# Altium project ESP32-CAM-POW.PrjPCB
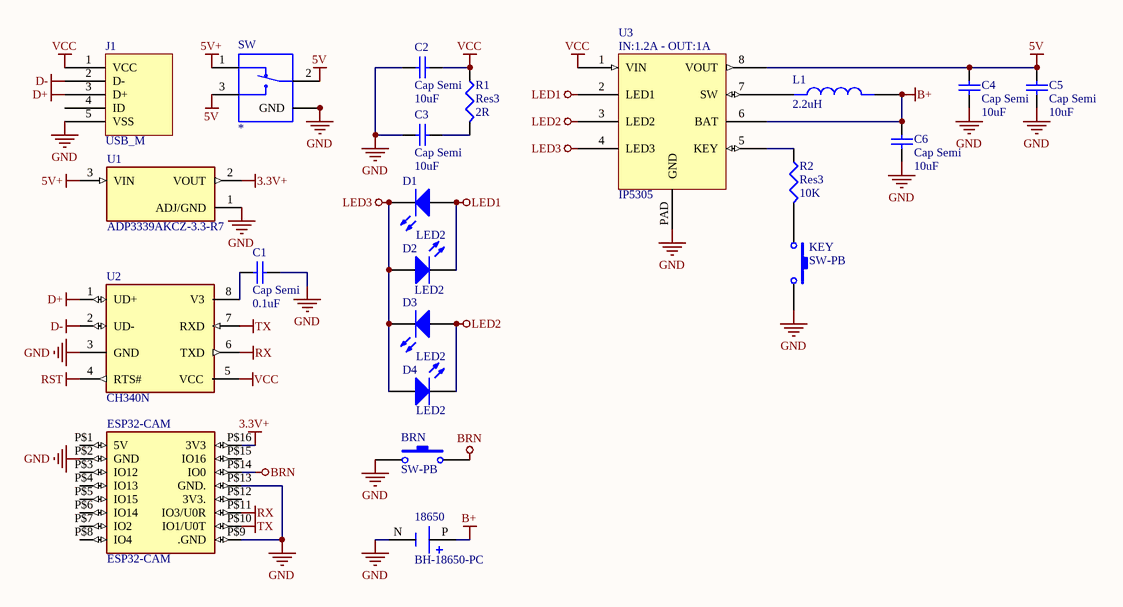
[diagram p0: POW.SchDoc]
1 sheet, 22 parts. Net scope: global (net labels, ports and power ports of the same name join across sheets).
Board file: POW.PcbDoc

## Sheet POW.SchDoc
size A4

### Parts
18650  BH-18650-PC  [BAT_BH-18650-PC]
BRN  SW-PB  [SW_PB2_B1]
C1  Cap Semi  value 0.1uF  [C1206]
C2  Cap Semi  value 10uF  [C1210]
C3  Cap Semi  value 10uF  [C1210]
C4  Cap Semi  value 10uF  [C1210]
C5  Cap Semi  value 10uF  [C1210]
C6  Cap Semi  value 10uF  [C1210]
D1  LED2  [3.2X1.6X1.1]
D2  LED2  [3.2X1.6X1.1]
D3  LED2  [3.2X1.6X1.1]
D4  LED2  [3.2X1.6X1.1]
ESP32-CAM  ESP32-CAM  [ESP32-CAM]
J1  USB_M  [USB_MICRO]
KEY  SW-PB  [SW_PB2_B1]
L1  2.2uH  [IND_1253AY-100M=P3]
R1  Res3  value 2R  [J1-0603]
R2  Res3  value 10K  [J1-0603]
SW  1437575-1  [SW_MLL1200S]  (value not drawn)
U1  ADP3339AKCZ-3.3-R7  [SOT229P700X180-4N]
U2  CH340N  [SOP-8]
U3  IP5305  [SOP-8]

### Nets
3.3V+: ESP32-CAM.P$16(3V3) U1.2(VOUT)
5V: C4.2 C5.2 SW.2 SW.3 U3.8(VOUT)
5V+: SW.1 U1.3(VIN)
B+: 18650.P(POS) C6.2 L1.2 U3.6(BAT)
BRN: BRN.2 ESP32-CAM.P$14(IO0)
D+: J1.3(D+) U2.1(UD+)
D-: J1.2(D-) U2.2(UD-)
GND: 18650.N(NEG) BRN.1 C1.2 C2.1 C3.2 C4.1 C5.1 C6.1 ESP32-CAM.P$2(GND) ESP32-CAM.P$9(.GND) ESP32-CAM.P$13(GND.) J1.5(VSS) KEY.2 SW.G1(GND) SW.G2(GND) SW.G3(GND) SW.G4(GND) U1.1(ADJ/GND) U2.3(GND) U3.PAD(GND)
LED1: D1.1(A) D2.2(K) U3.2(LED1)
LED2: D3.1(A) D4.2(K) U3.3(LED2)
LED3: D1.2(K) D2.1(A) D3.2(K) D4.1(A) U3.4(LED3)
RST: U2.4(RTS#)
RX: ESP32-CAM.P$11(IO3/U0R) U2.6(TXD)
TX: ESP32-CAM.P$10(IO1/U0T) U2.7(RXD)
VCC: C2.2 J1.1(VCC) R1.1 U2.5(VCC) U3.1(VIN)
NetC1_1: C1.1 U2.8(V3)
NetC3_1: C3.1 R1.2
NetKEY_1: KEY.1 R2.2
NetL1_1: L1.1 U3.7(SW)
NetR2_1: R2.1 U3.5(KEY)

Not connected (* = marked no-connect by the designer): ESP32-CAM P$1(5V) P$3(IO12) P$4(IO13) P$5(IO15) P$6(IO14) P$7(IO2) P$8(IO4) P$12(3V3.) P$15(IO16); J1 4(ID)

### Notes on the sheet
- (in symbol IP5305) IN:1.2A - OUT:1A

### Library data of the parts
18650 = BH-18650-PC: Battery Holder _Open_ 18650 1 Cell PC Pin; MF: MPD _Memory; Package: DFN-8 Memory Protection Devices; MP: BH-18650-PC; Value: *; Availability: Unavailable; SnapEDA_Link: https://www.snapeda.com/parts/BH-18650-PC/MPD%20%28Memory%20Protection%20Devices%29/view-part/779074/?ref=snap; Price: None
BRN KEY = SW-PB: 峚雄羲壽; Published: 24-Mar-1999; LatestRevisionDate: 17-Jul-2002; LatestRevisionNote: Re-released for DXP Platform.; PackageReference: SPST-2; Publisher: Altium Limited
C1-C6 = Cap Semi: Capacitor (Semiconductor SIM Model); Published: 8-Jun-2000; LatestRevisionDate: 29-May-2009; LatestRevisionNote: IPC-7351 Footprint Added.; PackageReference: C1206; Publisher: Altium Limited; PackageDescription: Chip Capacitor
D1-D4 = LED2: Typical RED, GREEN, YELLOW, AMBER GaAs LED; Published: 8-Jun-2000; LatestRevisionDate: 17-Jul-2002; LatestRevisionNote: Re-released for DXP Platform.; PackageVersion: Feb-2002; PackageReference: 3.2X1.6X1.1; Publisher: Altium Limited; PackageDescription: SM LED; 2 Flat Leads
ESP32-CAM = ESP32-CAM: The smallest 802.11b/g/n Wi-Fi BT SoC Module; MF: AI-Thinker; Price: None; Value: *; Check_prices: https://www.snapeda.com/parts/ESP32-CAM/AI-Thinker/view-part/5507632/?ref=eda; Package: Package; Availability: No availability data; MP: ESP32-CAM; SnapEDA_Link: https://www.snapeda.com/parts/ESP32-CAM/AI-Thinker/view-part/5507632/?ref=snap
J1 = USB_M: MicroUSB諉諳
L1 = 1253AY-100M=P3: Inductor with Inductance: 10uH Tol. +/-20%, Package: 2424 (6060); MF: Murata; Check_prices: https://www.snapeda.com/parts/1253AY-100M=P3/Murata/view-part/1552786/?ref=eda; Value: *; Price: None; Availability: Bad; Package: NONSTANDARD; MP: 1253AY-100M=P3; SnapEDA_Link: https://www.snapeda.com/parts/1253AY-100M=P3/Murata/view-part/1552786/?ref=snap
R1 R2 = Res3: Resistor; Published: 8-Jun-2000; LatestRevisionDate: 29-May-2009; LatestRevisionNote: IPC-7351 Footprint Added.; PackageReference: J1-0603; Publisher: Altium Limited; PackageDescription: Chip Resistor
SW = MLL1200S: Slide Switch SPDT Surface Mount, Right Angle; MF: TE Connectivity; Value: *; Package: None; Digi-Key_Purchase_URL: https://www.digikey.lt/product-detail/en/te-connectivity-alcoswitch-switches/MLL1200S/450-1577-ND/1201378?utm_source=snapeda&utm_medium=aggregator&utm_campaign=symbol; Digi-Key_Part_Number: 450-1577-ND; TE_purchase_URL: https://www.te.com/usa-en/product-1437575-1.html?te_bu=Cor&te_type=disp&te_campaign=seda_glo_cor-seda-global-disp-prtnr-fy19-seda-model-bom-cta_sma-317_1&elqCampaignId=32493; SnapEDA_Link: https://www.snapeda.com/parts/MLL1200S/TE%20Connectivity%20ALCOSWITCH%20Switches/view-part/1494234/?ref=snap; MP: MLL1200S; Comment_1: *
U1 = AMS1117-3.3: Sot223/Pkg 1-Amp 3.3-Volt Low Drop Out Voltage Regulatator; MF: Advanced Monolithic Systems; Price: None; Package: None; Value: *; MP: AMS1117-3.3; Availability: Unavailable; SnapEDA_Link: https://www.snapeda.com/parts/AMS1117-3.3/Advanced%20Monolithic%20Systems/view-part/53450/?ref=snap
U2 = CH340N: Complete single cell Li-Ion battery with a constant current / constant voltage linear charger; MP: TP4056; MF: NanJing Top Power ASIC Corp.; Package: Package Analog Devices; Value: *; SnapEDA_Link: https://www.snapeda.com/parts/TP4056%20/NanJing%20Top%20Power%20ASIC%20Corp./view-part/2888426/?ref=snap; Price: None; Availability: Unavailable